# EasyEDA schematic module.json
TITLE: Sheet_1; REV: 1.0; Date: 2021-04-07; Sheet: 1/1; Drawn By: Suresh Kumar Gadi; Company: Your Company
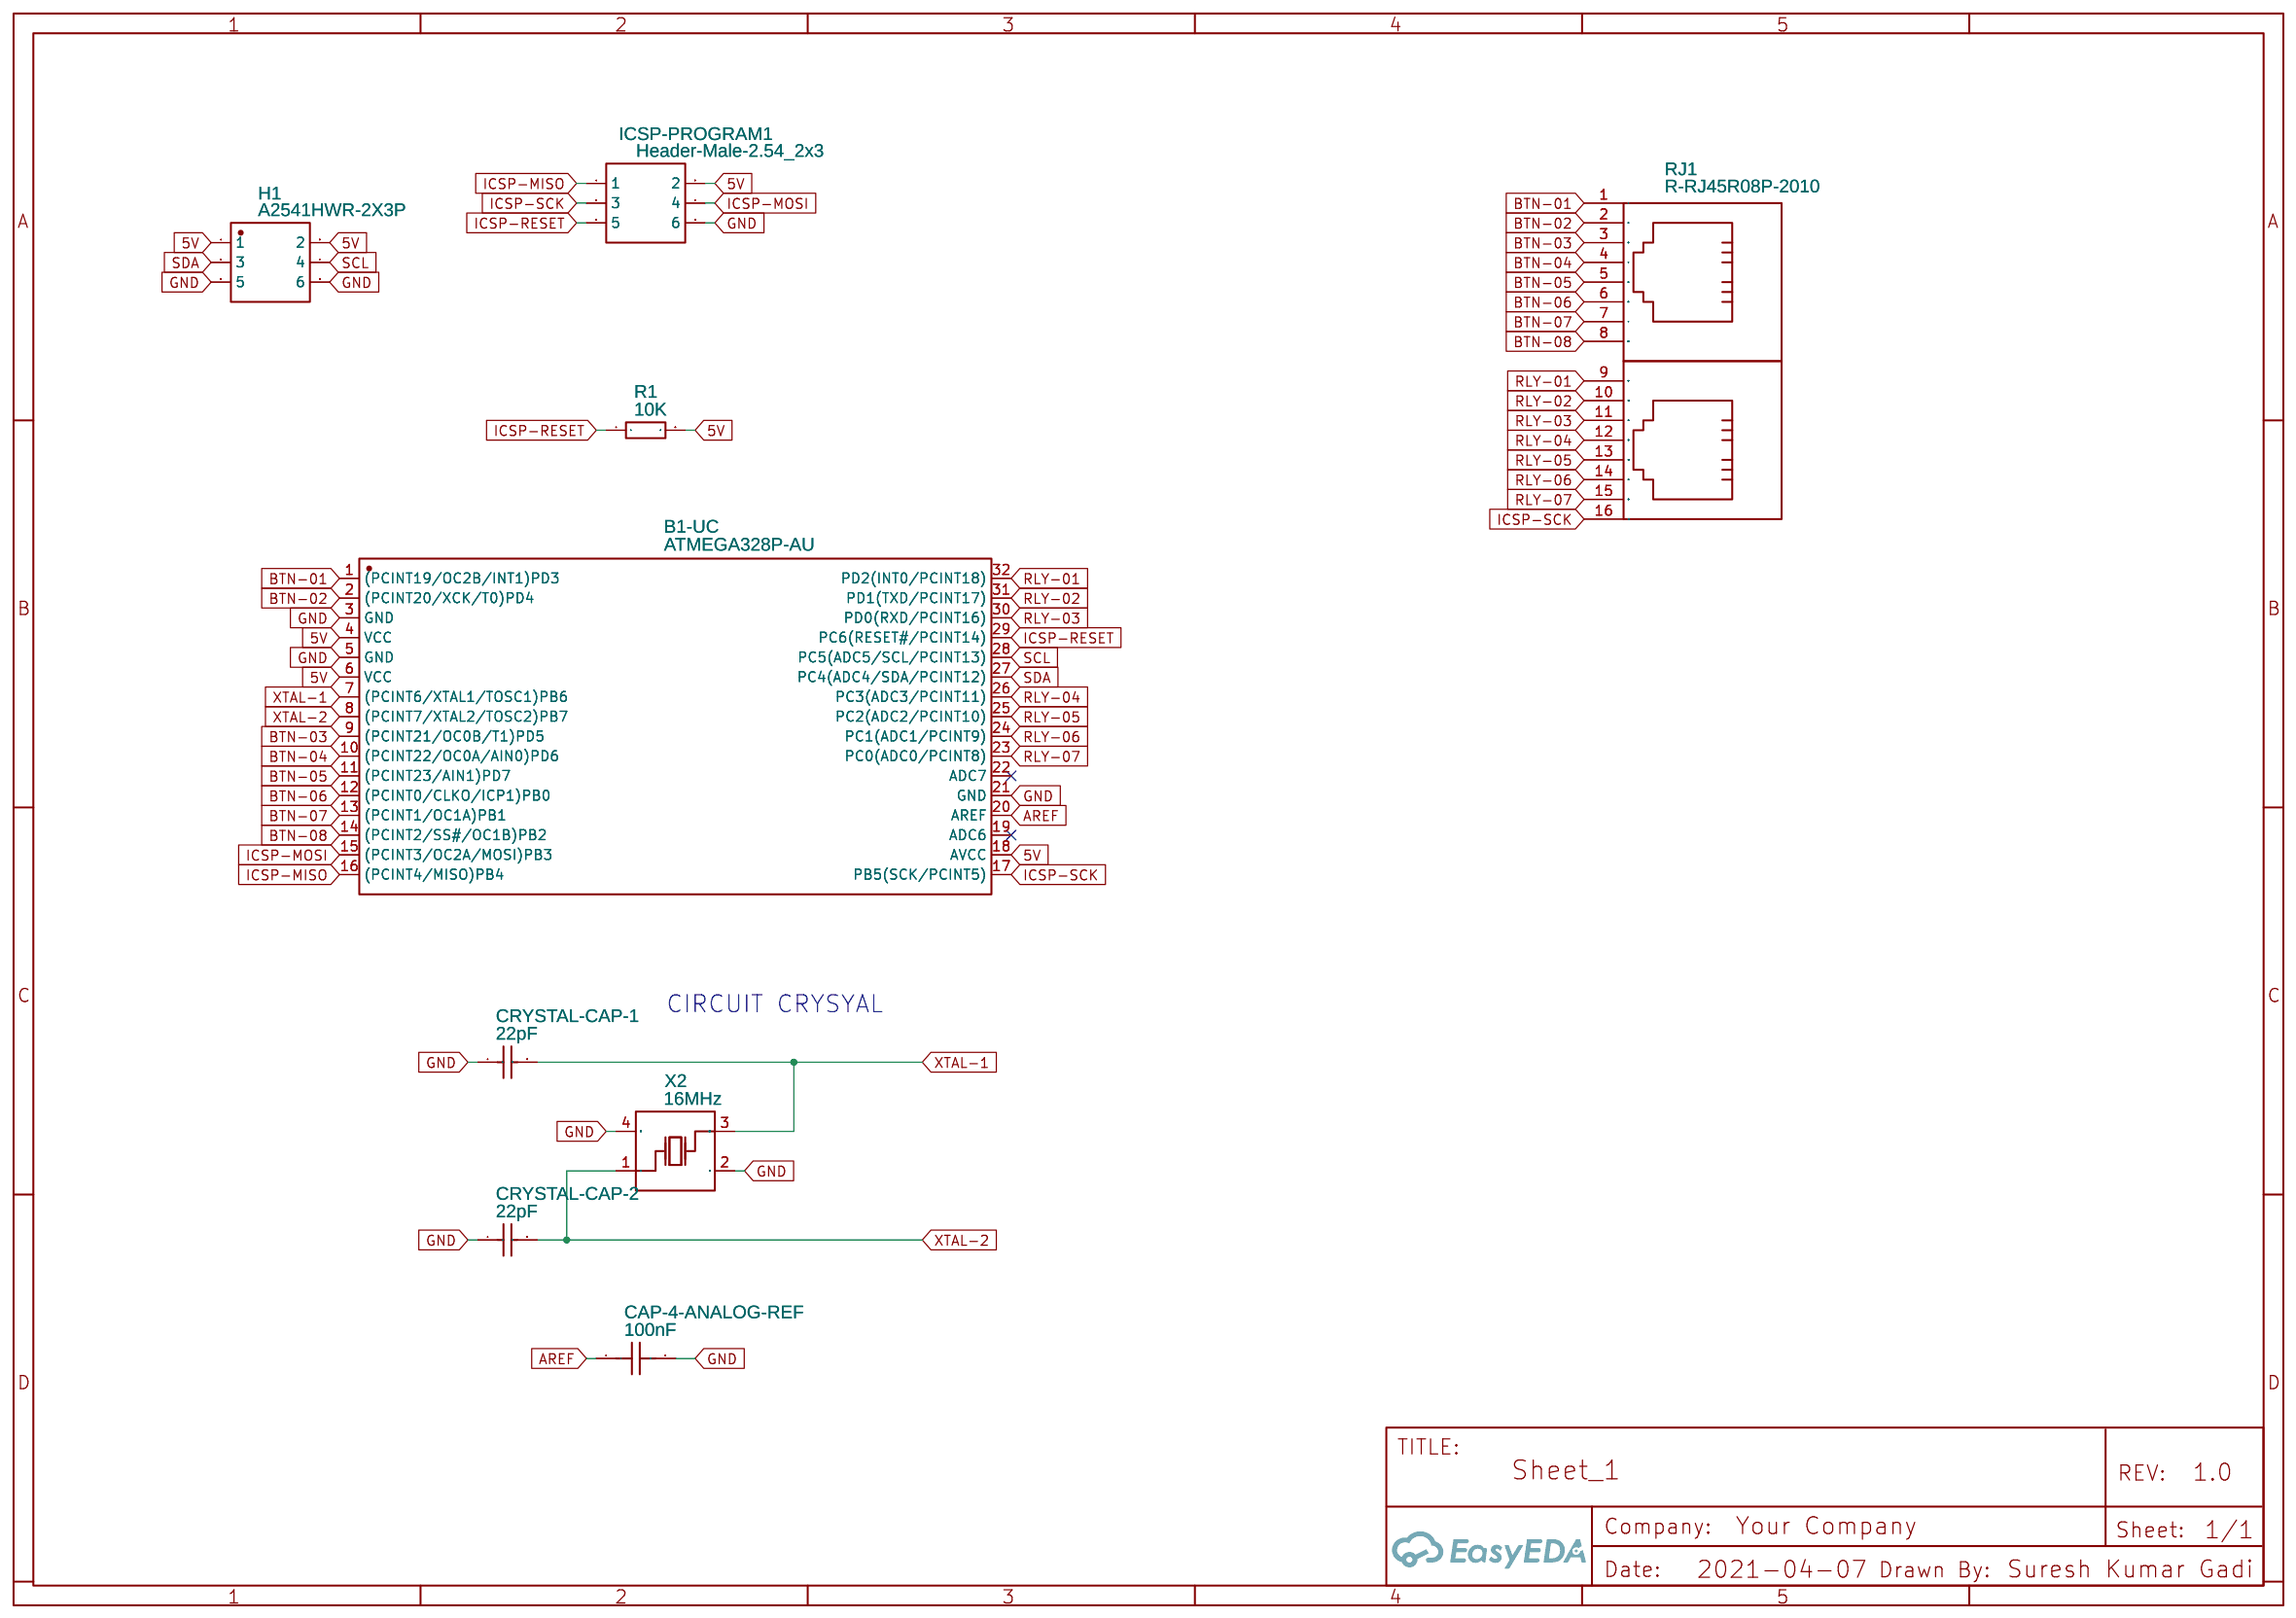
[diagram p0: schematic sheet]

## Parts
B1-UC  ATMEGA328P-AU  [TQFP-32_L7.0-W7.0-P0.80-LS9.0-BL]
CAP-4-ANALOG-REF  100nF  [C0603]
CRYSTAL-CAP-1  22pF  [C0805]
CRYSTAL-CAP-2  22pF  [C0805]
H1  A2541HWR-2X3P  [HDR-TH_6P-P2.54-H-R2-C3-S2.54-W10.2]
ICSP-PROGRAM1  Header-Male-2.54_2x3  [HDR-TH_6P-P2.54-V-R2-C3-S2.54]
R1  10K  [R1206]
RJ1  R-RJ45R08P-2010  [RJ45-TH_R-RJ45R08P-2010]
X2  16MHz  [OSC-SMD_4P-L3.2-W2.5-BL]

## Library data of the parts
B1-UC = ATMEGA328P-AU: Supplier: LCSC; Manufacturer: MICROCHIP; image: //image.lceda.cn/szlcsc/C14877.jpg; Supplier Part: C14877; SMT Type: Basic; JLCPCB SMD: Yes; LCSC Assembly: Yes; Paste Type: base
CAP-4-ANALOG-REF = CC0603KRX7R9BB104: Supplier: LCSC; Manufacturer: YAGEO; Supplier Part: C14663; SMT Type: Basic; JLCPCB SMD: Yes; LCSC Assembly: Yes; Paste Type: base
CRYSTAL-CAP-1 CRYSTAL-CAP-2 = CL21C220JBANNNC: Supplier: LCSC; Manufacturer: SAMSUNG; Supplier Part: C1804; SMT Type: Basic; JLCPCB SMD: Yes; LCSC Assembly: Yes; Paste Type: base
H1 = A2541HWR-2X3P: Supplier: LCSC; Supplier Part: C239354; Manufacturer: Changjiang Connectors; Manufacturer Part: A2541HWR-2x3P; Contributor: LCSC; link: https://item.szlcsc.com/238458.html?ref=editor&logined=true; LCSC Assembly: Yes; SMT Type: Extend; Paste Type: expand
ICSP-PROGRAM1 = Header-Male-2.54_2x3: Supplier: LCSC; Manufacturer: BOOMELE; Supplier Part: C65114; LCSC Assembly: Yes; SMT Type: Extend; Paste Type: expand
R1 = 1206W4F1002T5E: Supplier: LCSC; Manufacturer: UniOhm; Supplier Part: C17902; SMT Type: Basic; JLCPCB SMD: Yes; LCSC Assembly: Yes; Paste Type: base
RJ1 = R-RJ45R08P-2010: Supplier: LCSC; Supplier Part: C508566; Manufacturer: Ckmtw(Shenzhen Cankemeng); Contributor: LCSC; LCSC Assembly: Yes; SMT Type: Extend; Paste Type: expand
X2 = X322516MLB4SI: Supplier: LCSC; Manufacturer: YXC; Supplier Part: C13738; SMT Type: Basic; JLCPCB SMD: Yes; LCSC Assembly: Yes; Paste Type: base

## Nets
5V: B1-UC.4(VCC) B1-UC.6(VCC) B1-UC.18(AVCC) H1.1 H1.2 ICSP-PROGRAM1.2 R1.2
GND: B1-UC.3(GND) B1-UC.5(GND) B1-UC.21(GND) CAP-4-ANALOG-REF.2 CRYSTAL-CAP-1.1 CRYSTAL-CAP-2.1 H1.5 H1.6 ICSP-PROGRAM1.6 X2.2(GND) X2.4(GND)
AREF: B1-UC.20(AREF) CAP-4-ANALOG-REF.1
BTN-01: B1-UC.1((PCINT19/OC2B/INT1)PD3) RJ1.1
BTN-02: B1-UC.2((PCINT20/XCK/T0)PD4) RJ1.2
BTN-03: B1-UC.9((PCINT21/OC0B/T1)PD5) RJ1.3
BTN-04: B1-UC.10((PCINT22/OC0A/AIN0)PD6) RJ1.4
BTN-05: B1-UC.11((PCINT23/AIN1)PD7) RJ1.5
BTN-06: B1-UC.12((PCINT0/CLKO/ICP1)PB0) RJ1.6
BTN-07: B1-UC.13((PCINT1/OC1A)PB1) RJ1.7
BTN-08: B1-UC.14((PCINT2/SS#/OC1B)PB2) RJ1.8
ICSP-MISO: B1-UC.16((PCINT4/MISO)PB4) ICSP-PROGRAM1.1
ICSP-MOSI: B1-UC.15((PCINT3/OC2A/MOSI)PB3) ICSP-PROGRAM1.4
ICSP-RESET: B1-UC.29(PC6(RESET#/PCINT14)) ICSP-PROGRAM1.5 R1.1
ICSP-SCK: B1-UC.17(PB5(SCK/PCINT5)) ICSP-PROGRAM1.3 RJ1.16
RLY-01: B1-UC.32(PD2(INT0/PCINT18)) RJ1.9
RLY-02: B1-UC.31(PD1(TXD/PCINT17)) RJ1.10
RLY-03: B1-UC.30(PD0(RXD/PCINT16)) RJ1.11
RLY-04: B1-UC.26(PC3(ADC3/PCINT11)) RJ1.12
RLY-05: B1-UC.25(PC2(ADC2/PCINT10)) RJ1.13
RLY-06: B1-UC.24(PC1(ADC1/PCINT9)) RJ1.14
RLY-07: B1-UC.23(PC0(ADC0/PCINT8)) RJ1.15
SCL: B1-UC.28(PC5(ADC5/SCL/PCINT13)) H1.4
SDA: B1-UC.27(PC4(ADC4/SDA/PCINT12)) H1.3
XTAL-1: B1-UC.7((PCINT6/XTAL1/TOSC1)PB6) CRYSTAL-CAP-1.2 X2.3(OSC2)
XTAL-2: B1-UC.8((PCINT7/XTAL2/TOSC2)PB7) CRYSTAL-CAP-2.2 X2.1(OSC1)

Not connected (* = marked no-connect by the designer): B1-UC 19(ADC6)* 22(ADC7)*

## Notes on the sheet
- CIRCUIT CRYSYAL
